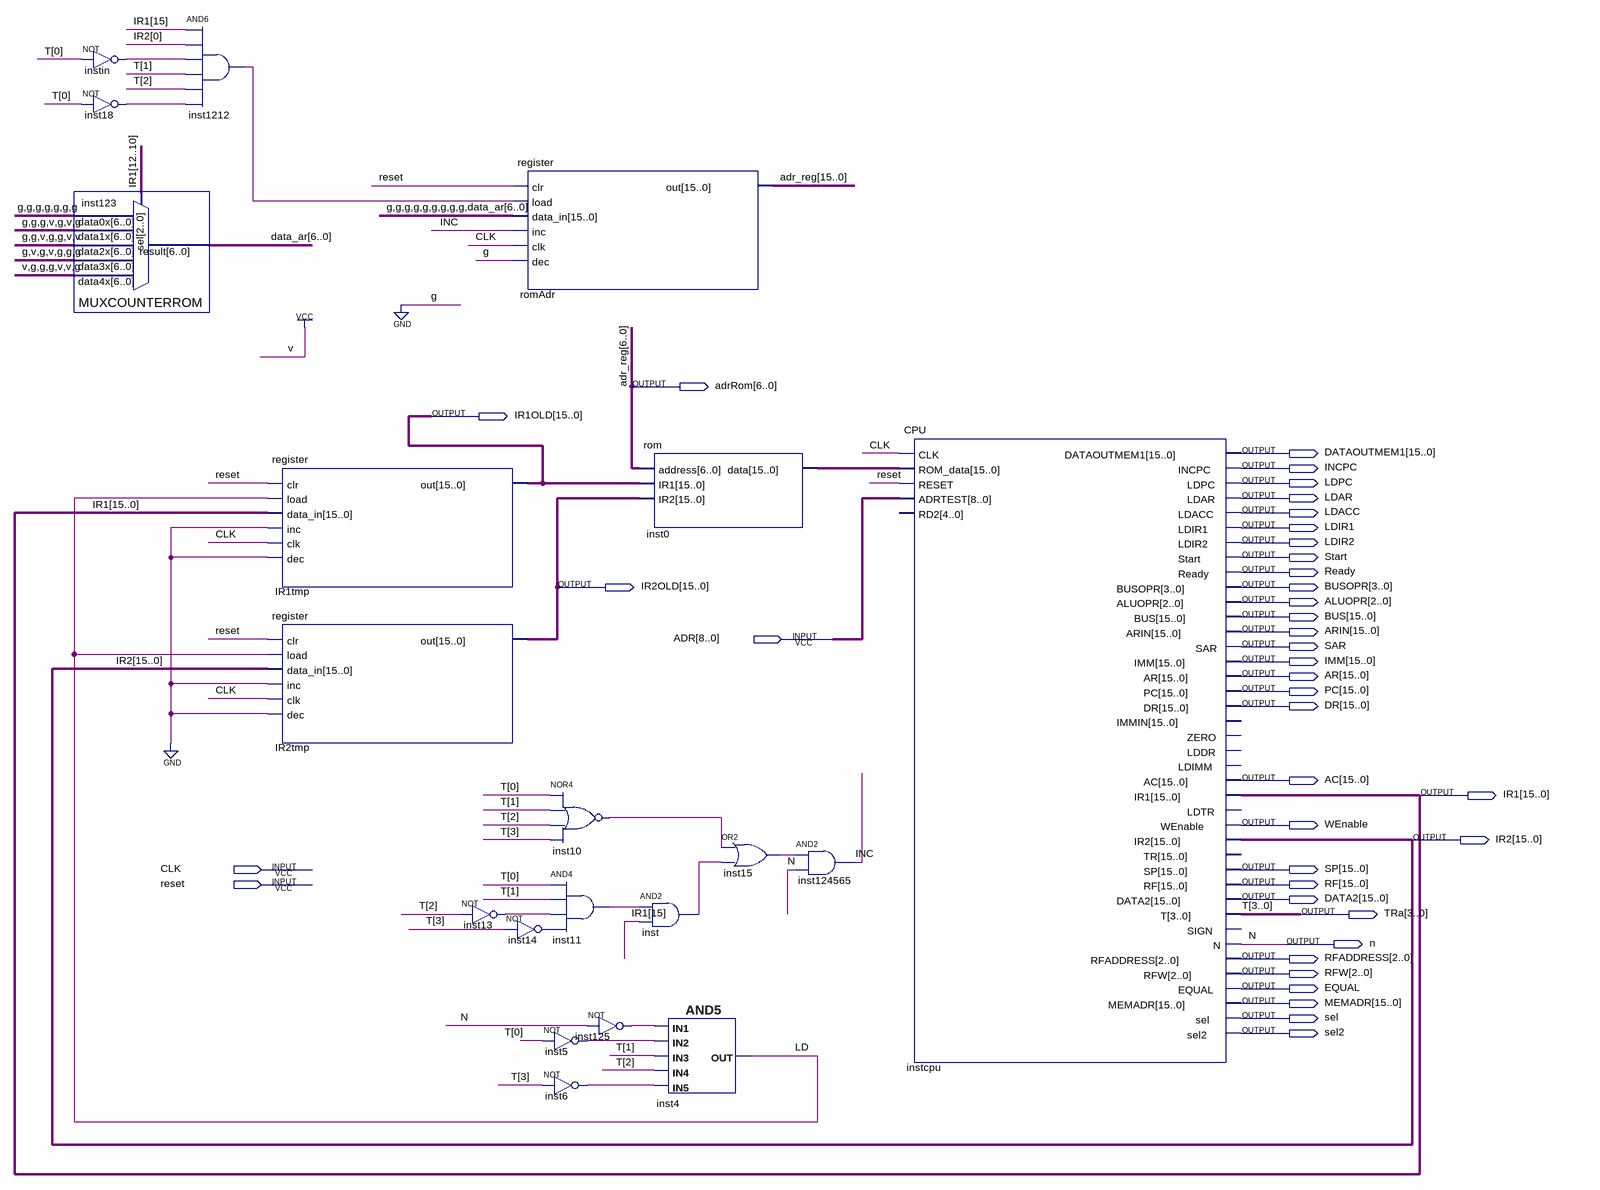
[diagram p0: schematic sheet]
// Quartus schematic comp.bdf as structural Verilog: 20 symbols, 39 pins
module comp (
  input  [8:0] ADR,
  input  CLK,
  input  reset,
  output [6:0] adrRom,
  output [15:0] IR1OLD,
  output [15:0] DATAOUTMEM1,
  output INCPC,
  output LDPC,
  output LDAR,
  output LDACC,
  output LDIR1,
  output LDIR2,
  output Start,
  output Ready,
  output [15:0] IR2OLD,
  output [3:0] BUSOPR,
  output [2:0] ALUOPR,
  output [15:0] BUS,
  output [15:0] ARIN,
  output SAR,
  output [15:0] IMM,
  output [15:0] AR,
  output [15:0] PC,
  output [15:0] DR,
  output [15:0] AC,
  output [15:0] IR1,
  output WEnable,
  output [15:0] IR2,
  output [15:0] SP,
  output [15:0] RF,
  output [15:0] DATA2,
  output [3:0] TRa,
  output n,
  output [2:0] RFADDRESS,
  output [2:0] RFW,
  output EQUAL,
  output [15:0] MEMADR,
  output sel,
  output sel2
);

  wire INC, inst5_out, inst6_out, inst10_out, inst11_out, inst13_out, inst14_out, inst15_out, inst18_out,
       inst125_out, inst1212_out, inst_out, instin_out, LD;
  wire [6:0] data_ar;
  wire [15:0] inst0_data;
  wire [15:7] adr_reg;

  not instin (instin_out, TRa[0]);
  not inst18 (inst18_out, TRa[0]);
  MUXCOUNTERROM inst123 (
    .data4x(7'b1000110), .data3x(7'b0101000), .data2x(7'b0010011), .data1x(7'b0001010), .data0x({7{1'b0}}),
    .sel(IR1[12:10]), .result(data_ar));
  and inst1212 (inst1212_out, IR1[15], IR2[0], instin_out, TRa[1], TRa[2], inst18_out);
  register IR1tmp (.clr(reset), .load(LD), .data_in(IR1), .inc(1'b0), .clk(CLK), .dec(1'b0), .out(IR1OLD));
  register IR2tmp (.clr(reset), .load(LD), .data_in(IR2), .inc(1'b0), .clk(CLK), .dec(1'b0), .out(IR2OLD));
  register romAdr (
    .clr(reset), .load(inst1212_out), .data_in({{9{1'b0}}, data_ar}), .inc(INC), .clk(CLK), .dec(1'b0),
    .out({adr_reg, adrRom}));
  not inst13 (inst13_out, TRa[2]);
  not inst14 (inst14_out, TRa[3]);
  nor inst10 (inst10_out, TRa[0], TRa[1], TRa[2], TRa[3]);
  and inst11 (inst11_out, TRa[0], TRa[1], inst13_out, inst14_out);
  not inst5 (inst5_out, TRa[0]);
  not inst6 (inst6_out, TRa[3]);
  not inst125 (inst125_out, n);
  rom inst0 (.address(adrRom), .IR1(IR1OLD), .IR2(IR2OLD), .data(inst0_data));
  and inst (inst_out, inst11_out, IR1[15]);
  and inst4 (LD, inst125_out, inst5_out, TRa[1], TRa[2], inst6_out);
  or inst15 (inst15_out, inst10_out, inst_out);
  and inst124565 (INC, inst15_out, n);
  CPU instcpu (
    .CLK(CLK), .ROM_data(inst0_data), .RESET(reset), .ADRTEST(ADR), .DATAOUTMEM1(DATAOUTMEM1), .INCPC(INCPC),
    .LDPC(LDPC), .LDAR(LDAR), .LDACC(LDACC), .LDIR1(LDIR1), .LDIR2(LDIR2), .Start(Start), .Ready(Ready),
    .BUSOPR(BUSOPR), .ALUOPR(ALUOPR), .BUS(BUS), .ARIN(ARIN), .SAR(SAR), .IMM(IMM), .AR(AR), .PC(PC),
    .DR(DR), .AC(AC), .IR1(IR1), .WEnable(WEnable), .IR2(IR2), .SP(SP), .RF(RF), .DATA2(DATA2), .T(TRa),
    .N(n), .RFADDRESS(RFADDRESS), .RFW(RFW), .EQUAL(EQUAL), .MEMADR(MEMADR), .sel(sel), .sel2(sel2));  // open: RD2, IMMIN, ZERO, LDDR, LDIMM, LDTR, TR, SIGN

  // Other names for the same wires on the sheet: adr_reg[6:0] = adrRom; T[3:0] = TRa
endmodule
